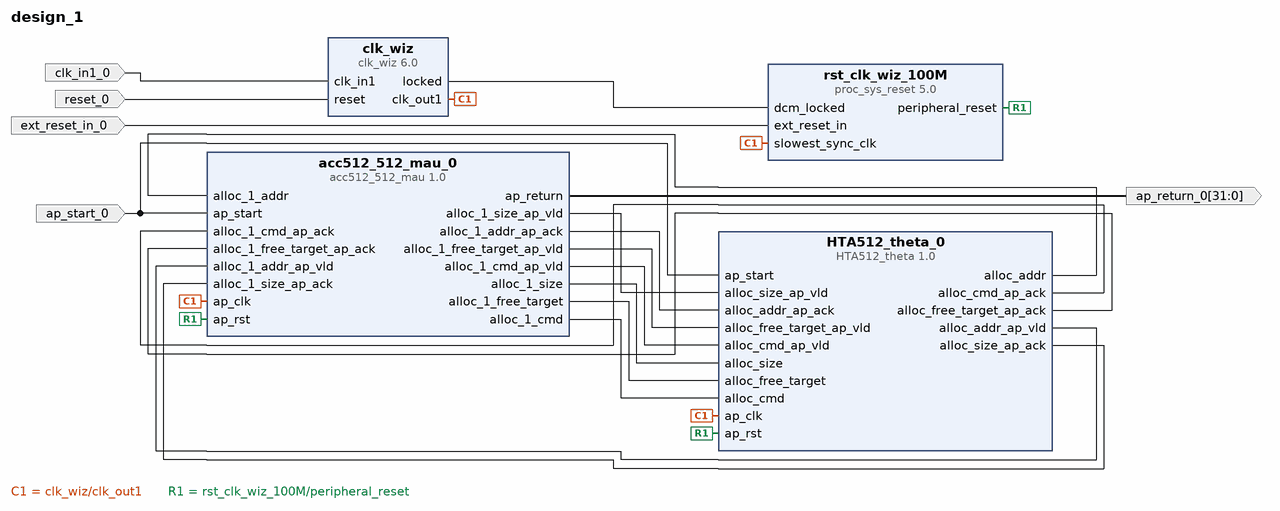
[diagram p0: block diagram of the top level]
# Vivado block design design_1, xc7z020clg484-1, Vivado 2018.2
create_bd_design design_1

create_bd_port -dir I -type clk clk_in1_0
create_bd_port -dir I -type rst reset_0
set_property -dict {CONFIG.POLARITY ACTIVE_HIGH} [get_bd_ports reset_0]
create_bd_port -dir I -type rst ext_reset_in_0
create_bd_port -dir I ap_start_0
create_bd_port -dir O -from 31 -to 0 -type data ap_return_0

create_bd_cell -type ip -vlnv xilinx.com:ip:clk_wiz:6.0 clk_wiz
create_bd_cell -type ip -vlnv xilinx.com:ip:proc_sys_reset:5.0 rst_clk_wiz_100M
create_bd_cell -type ip -vlnv xilinx.com:hls:acc512_512_mau:1.0 acc512_512_mau_0
create_bd_cell -type ip -vlnv xilinx.com:hls:HTA512_theta:1.0 HTA512_theta_0

# ---- connections ----

connect_bd_net [get_bd_pins clk_wiz/clk_out1] \
  [get_bd_pins rst_clk_wiz_100M/slowest_sync_clk] [get_bd_pins acc512_512_mau_0/ap_clk] [get_bd_pins HTA512_theta_0/ap_clk]
connect_bd_net [get_bd_pins clk_wiz/locked] [get_bd_pins rst_clk_wiz_100M/dcm_locked]
connect_bd_net [get_bd_pins rst_clk_wiz_100M/peripheral_reset] [get_bd_pins acc512_512_mau_0/ap_rst] [get_bd_pins HTA512_theta_0/ap_rst]
connect_bd_net -net clk_in1_0_1 [get_bd_ports clk_in1_0] [get_bd_pins clk_wiz/clk_in1]
connect_bd_net -net reset_0_1 [get_bd_ports reset_0] [get_bd_pins clk_wiz/reset]
connect_bd_net -net ext_reset_in_0_1 [get_bd_ports ext_reset_in_0] [get_bd_pins rst_clk_wiz_100M/ext_reset_in]
connect_bd_net -net ap_start_0_1 [get_bd_ports ap_start_0] [get_bd_pins acc512_512_mau_0/ap_start] [get_bd_pins HTA512_theta_0/ap_start]
connect_bd_net [get_bd_pins HTA512_theta_0/alloc_addr] [get_bd_pins acc512_512_mau_0/alloc_1_addr]
connect_bd_net [get_bd_pins HTA512_theta_0/alloc_cmd_ap_ack] [get_bd_pins acc512_512_mau_0/alloc_1_cmd_ap_ack]
connect_bd_net [get_bd_pins HTA512_theta_0/alloc_free_target_ap_ack] [get_bd_pins acc512_512_mau_0/alloc_1_free_target_ap_ack]
connect_bd_net [get_bd_pins HTA512_theta_0/alloc_addr_ap_vld] [get_bd_pins acc512_512_mau_0/alloc_1_addr_ap_vld]
connect_bd_net [get_bd_pins HTA512_theta_0/alloc_size_ap_ack] [get_bd_pins acc512_512_mau_0/alloc_1_size_ap_ack]
connect_bd_net [get_bd_pins acc512_512_mau_0/alloc_1_size_ap_vld] [get_bd_pins HTA512_theta_0/alloc_size_ap_vld]
connect_bd_net [get_bd_pins acc512_512_mau_0/alloc_1_addr_ap_ack] [get_bd_pins HTA512_theta_0/alloc_addr_ap_ack]
connect_bd_net [get_bd_pins acc512_512_mau_0/alloc_1_free_target_ap_vld] [get_bd_pins HTA512_theta_0/alloc_free_target_ap_vld]
connect_bd_net [get_bd_pins acc512_512_mau_0/alloc_1_cmd_ap_vld] [get_bd_pins HTA512_theta_0/alloc_cmd_ap_vld]
connect_bd_net [get_bd_pins acc512_512_mau_0/ap_return] [get_bd_ports ap_return_0]
connect_bd_net [get_bd_pins acc512_512_mau_0/alloc_1_size] [get_bd_pins HTA512_theta_0/alloc_size]
connect_bd_net [get_bd_pins acc512_512_mau_0/alloc_1_free_target] [get_bd_pins HTA512_theta_0/alloc_free_target]
connect_bd_net [get_bd_pins acc512_512_mau_0/alloc_1_cmd] [get_bd_pins HTA512_theta_0/alloc_cmd]

validate_bd_design
save_bd_design
